# EAGLE design PocketBeagle (EAGLE 9.6.2)
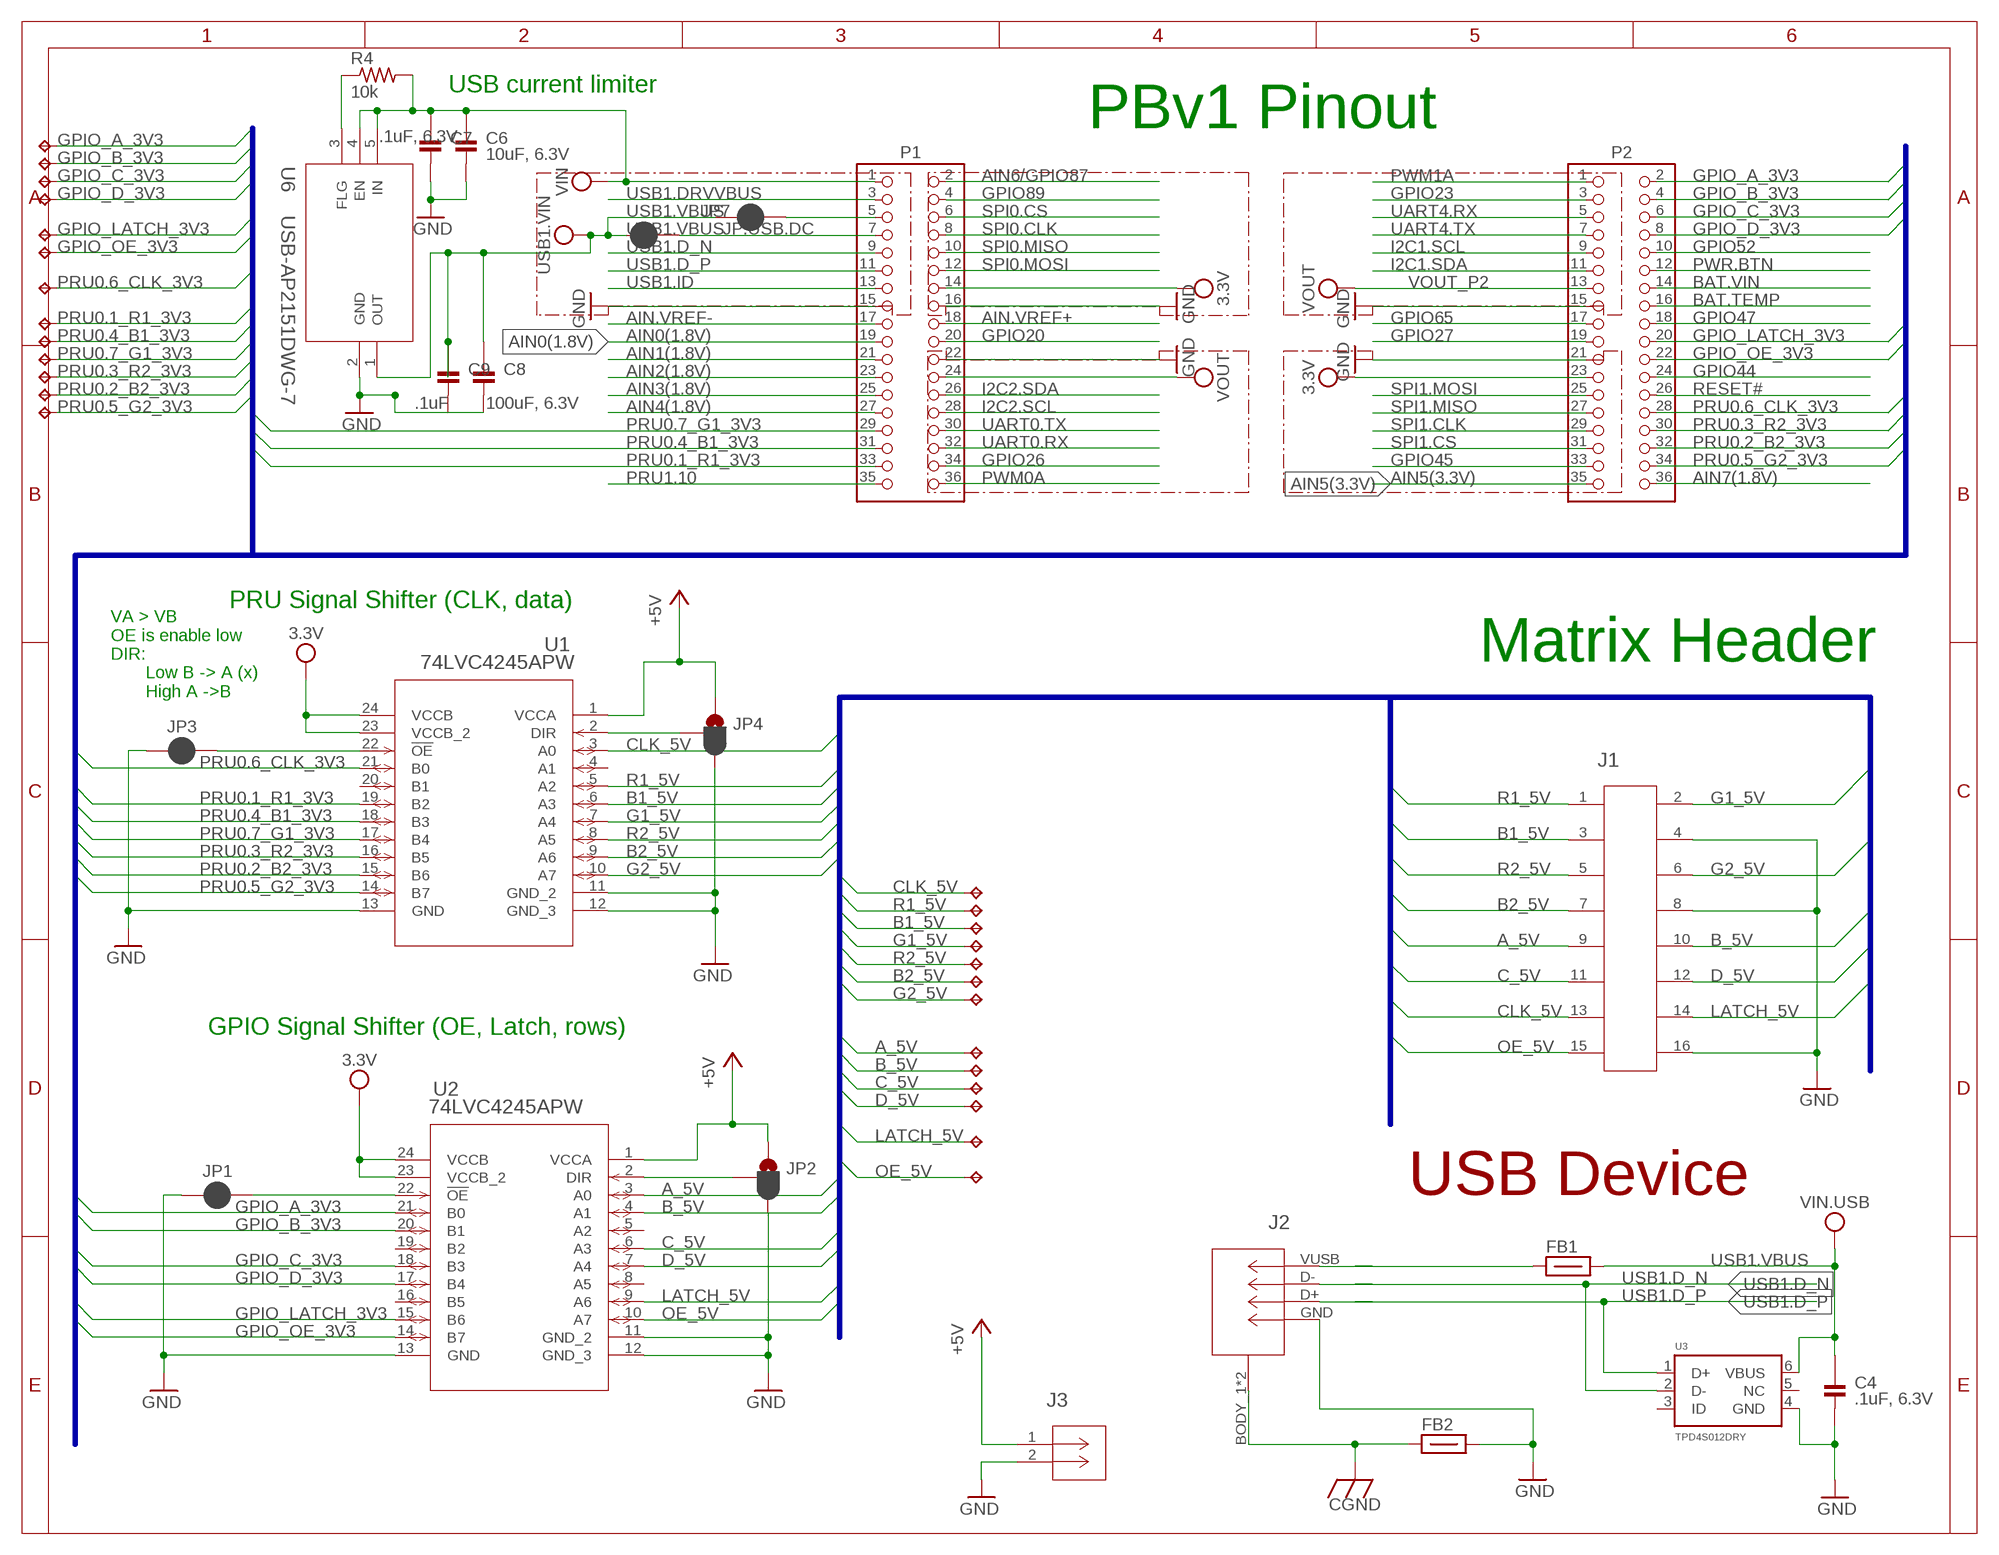
[diagram p0: schematic, sheet 1, part 1 of 2]
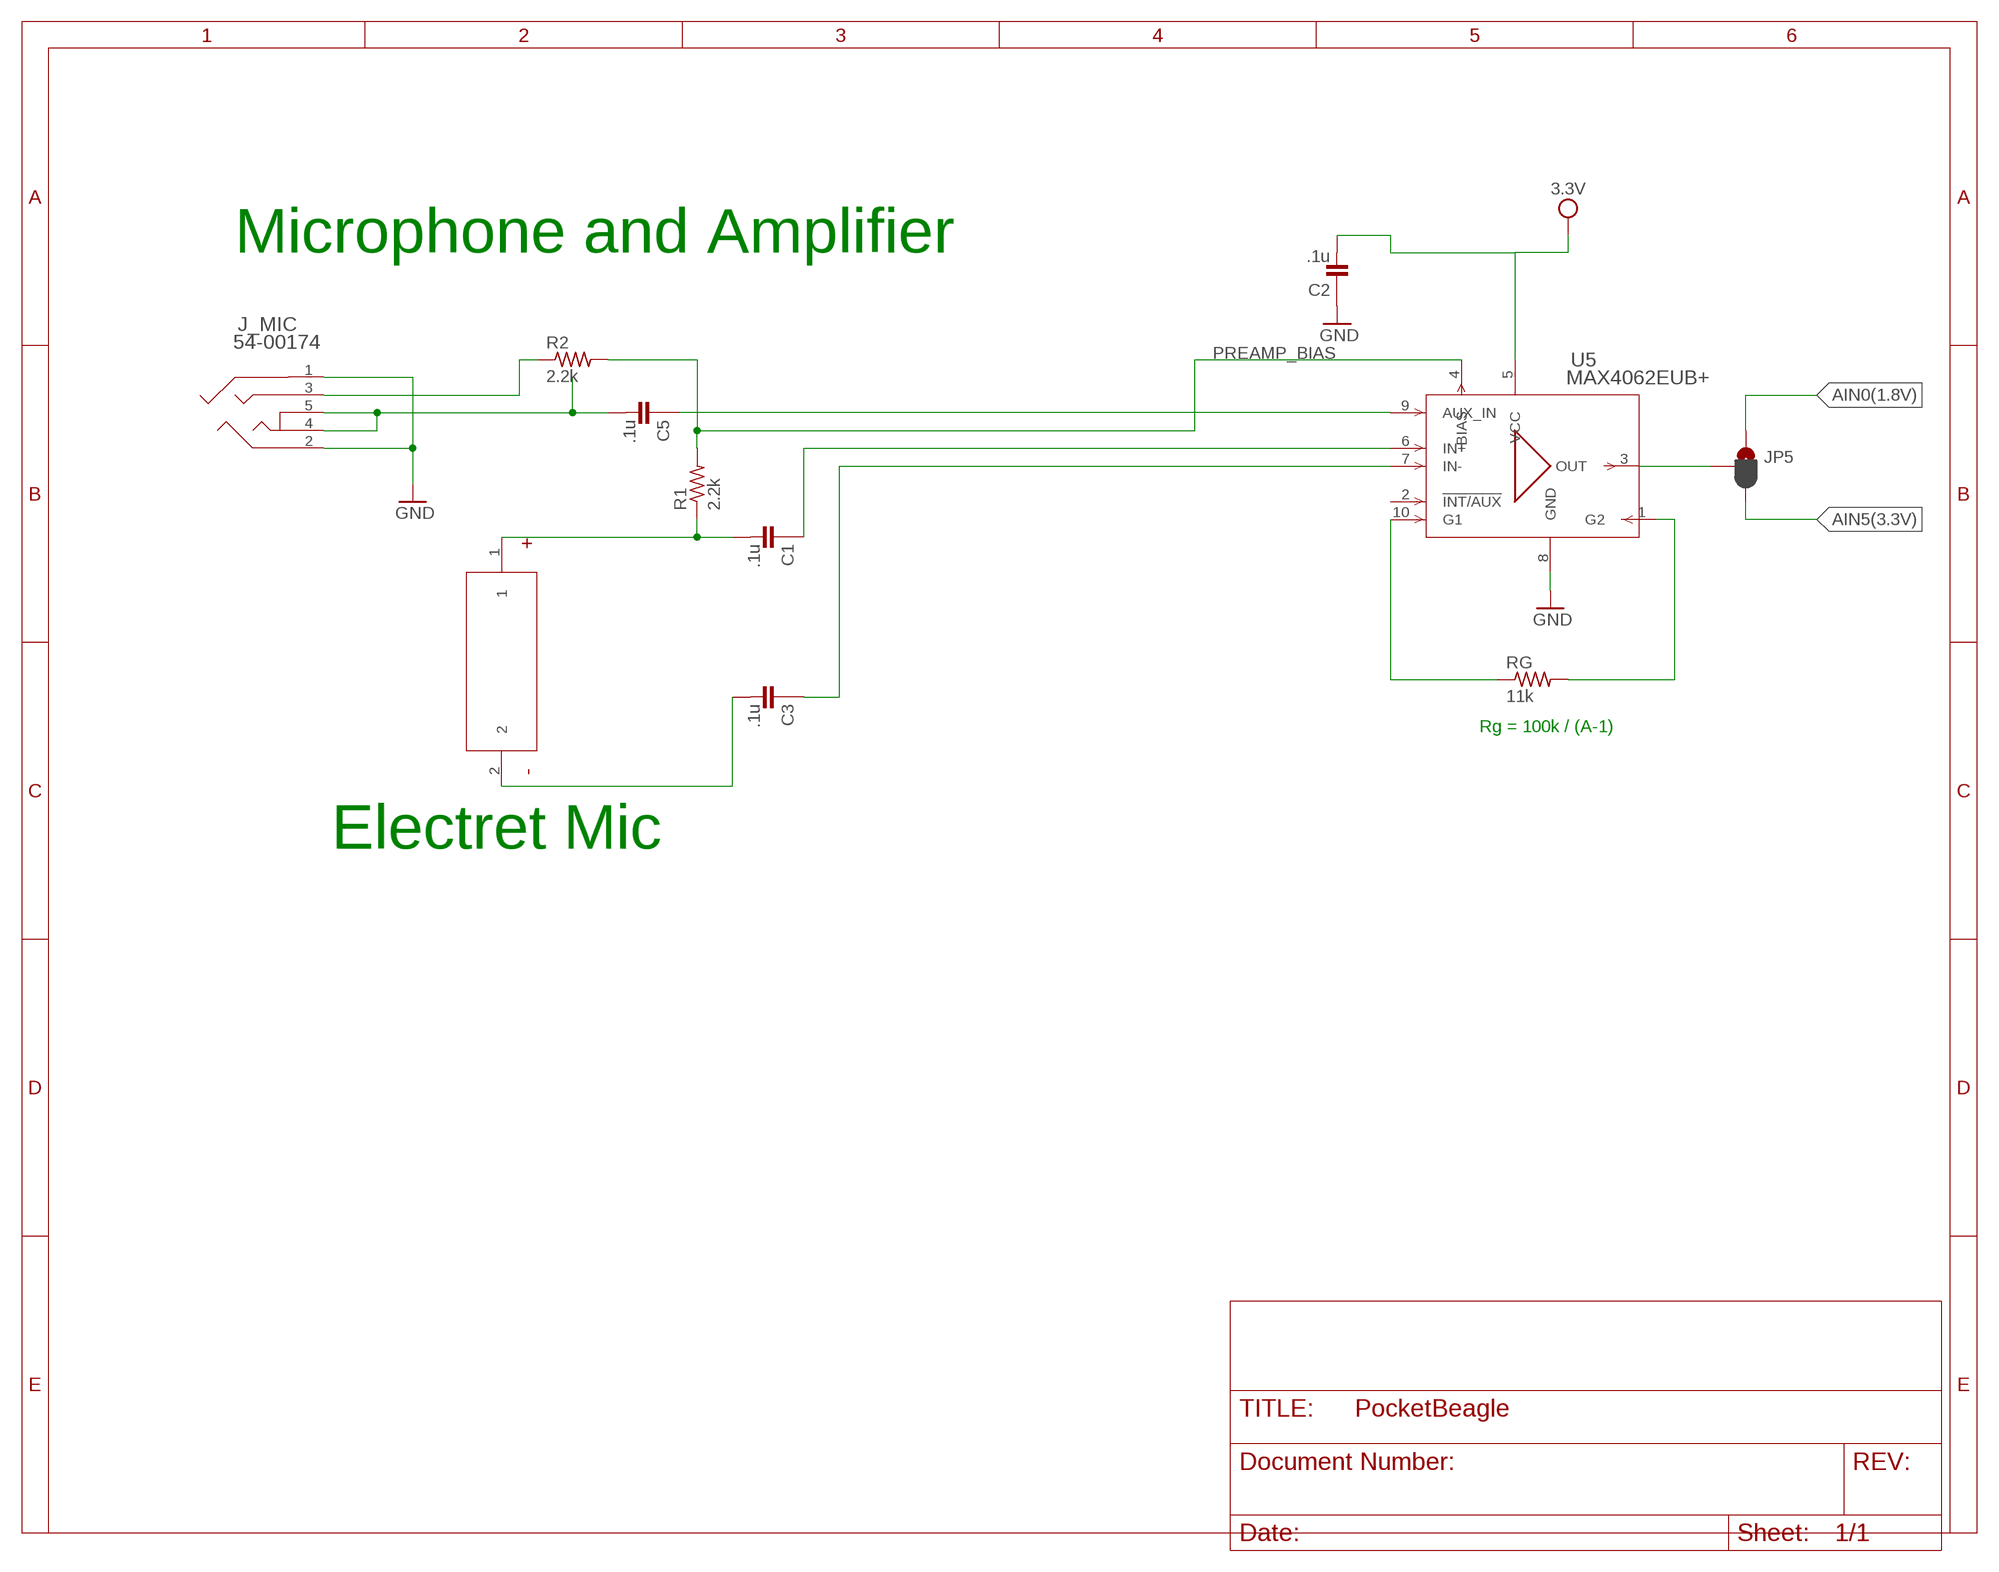
[diagram p1: schematic, sheet 1, part 2 of 2]

## Parts
C1  .1u  C-0805  [C0805]
C2  .1u  C-0805  [C0805]
C3  .1u  C-0805  [C0805]
C4  .1uF, 6.3V  C-0603  [C0603]
C5  .1u  C-0805  [C0805]
C6  10uF, 6.3V  C-0603  [C0603]
C7  .1uF, 6.3V  C-0603  [C0603]
C8  100uF, 6.3V  C-1206  [C1206]
C9  .1uF  C-0603  [C0603]
FB1  FB-(INCH)-0603  [0603]
FB2  FB-(INCH)-0603  [0603]
J1  SBH11-PBPC-D08-ST-BK  [CONN16_SBH11-PBPC-D08-ST-BK_SU]
J2  USB-61400416021  [CONN4_416021_WRE]
J3  1935161  [CONN_1935161_PXC]
J_MIC  54-00174  [54-00174_TEN]
JP1  JUMPER-SMT_2_NC_PASTE  [SMT-JUMPER_2_LG_NC_PASTE_NO-SILK]
JP2  JUMPER-SMT_3_1-NC_PASTE_SILK  [SMT-JUMPER_3_1-NC_PASTE_SILK]
JP3  JUMPER-SMT_2_NC_PASTE  [SMT-JUMPER_2_LG_NC_PASTE_NO-SILK]
JP4  JUMPER-SMT_3_1-NC_PASTE_SILK  [SMT-JUMPER_3_1-NC_PASTE_SILK]
JP5  JUMPER-SMT_3_1-NC_PASTE_SILK  [SMT-JUMPER_3_1-NC_PASTE_SILK]
JP7  JUMPER-SMT_2_NC_PASTE  [SMT-JUMPER_2_LG_NC_PASTE_NO-SILK]
JP.USB.DC  JUMPER-SMT_2_NC_PASTE  [SMT-JUMPER_2_LG_NC_PASTE_NO-SILK]
P1  2X18-(INCH)-0.1-TH-(35MIL-DIA)-W/O-SILK  [TH-2X18-(35MIL-DIA)-W/O-SILK]
P2  2X18-(INCH)-0.1-TH-(35MIL-DIA)-W/O-SILK  [TH-2X18-(35MIL-DIA)-W/O-SILK]
R1  2.2k  R-0805  [R0805]
R2  2.2k  R-0805  [R0805]
R4  10k  R-0805  [R0805]
RG  11k  R-0805  [R0805]
T.A.3  TPTP08R  [TP08R]
T.A.5  TPTP08R  [TP08R]
T.B1.3  TPTP08R  [TP08R]
T.B1.5  TPTP08R  [TP08R]
T.B2.3  TPTP08R  [TP08R]
T.B2.5  TPTP08R  [TP08R]
T.B.3  TPTP08R  [TP08R]
T.B.5  TPTP08R  [TP08R]
T.C.3  TPTP08R  [TP08R]
T.C.5  TPTP08R  [TP08R]
T.CL.3  TPTP08R  [TP08R]
T.CL.5  TPTP08R  [TP08R]
T.D.3  TPTP08R  [TP08R]
T.D.5  TPTP08R  [TP08R]
T.G1.3  TPTP08R  [TP08R]
T.G1.5  TPTP08R  [TP08R]
T.G2.3  TPTP08R  [TP08R]
T.G2.5  TPTP08R  [TP08R]
T.L.3  TPTP08R  [TP08R]
T.L.5  TPTP08R  [TP08R]
T.O.3  TPTP08R  [TP08R]
T.O.5  TPTP08R  [TP08R]
T.R1.3  TPTP08R  [TP08R]
T.R1.5  TPTP08R  [TP08R]
T.R2.3  TPTP08R  [TP08R]
T.R2.5  TPTP08R  [TP08R]
U1  74LVC4245APW  [SOT355-1_NEX]
U2  74LVC4245APW  [SOT355-1_NEX]
U3  TPD4S012DRY  TPD4S012DRYR  [SON-6(TI)-DRY]
U4  CMA-4544PF-W  [CMA_CUI_9P7X9P7_CUD]
U5  MAX4062EUB+  [21-0061L]
U6  USB-AP2151DWG-7  [SOT25_DIO]

## Nets
3V3: C2.2 P1.14 P2.23 U1.23(VCCB_2) U1.24(VCCB) U2.23(VCCB_2) U2.24(VCCB) U5.5(VCC) ; supply symbol labelled 3.3V
+5V: J3.1 JP2.1 JP4.1 U1.1(VCCA) U2.1(VCCA)
A_5V: J1.9 T.A.5.TP U2.3(A0)
AIN0(1.8V): JP5.1 P1.19
AIN1(1.8V): P1.21
AIN2(1.8V): P1.23
AIN3(1.8V): P1.25
AIN4(1.8V): P1.27
AIN5(3.3V): JP5.3 P2.35
AIN6/GPIO87: P1.2
AIN7(1.8V): P2.36
AIN.VREF+: P1.18
AIN.VREF-: P1.17
B1_5V: J1.3 T.B1.5.TP U1.6(A3)
B2_5V: J1.7 T.B2.5.TP U1.9(A6)
B_5V: J1.10 T.B.5.TP U2.4(A1)
BAT.TEMP: P2.16
BAT.VIN: P2.14
C_5V: J1.11 T.C.5.TP U2.6(A3)
CGND: FB2.1 J2.BODY_1(BODY) J2.BODY_2(BODY)
CLK_5V: J1.13 T.CL.5.TP U1.3(A0)
D_5V: J1.12 T.D.5.TP U2.7(A4)
G1_5V: J1.2 T.G1.5.TP U1.7(A4)
G2_5V: J1.6 T.G2.5.TP U1.10(A7)
GND [power]: C2.1 C4.2 C6.2 C7.2 C8.2 C9.2 FB2.2 J1.4 J1.8 J1.16 J2.GND(DGND) J3.2 J_MIC.1 J_MIC.2 JP1.2 JP2.3 JP3.2 JP4.3 P1.15 P1.16 P1.22 P2.15 P2.21 U1.11(GND_2) U1.12(GND_3) U1.13(GND) U2.11(GND_2) U2.12(GND_3) U2.13(GND) U3.4(GND) U5.8(GND) U6.2(GND)
GPIO20: P1.20
GPIO23: P2.3
GPIO26: P1.34
GPIO27: P2.19
GPIO44: P2.24
GPIO45: P2.33
GPIO47: P2.18
GPIO52: P2.10
GPIO65: P2.17
GPIO89: P1.4
GPIO_A_3V3: P2.2 T.A.3.TP U2.21(B0)
GPIO_B_3V3: P2.4 T.B.3.TP U2.20(B1)
GPIO_C_3V3: P2.6 T.C.3.TP U2.18(B3)
GPIO_D_3V3: P2.8 T.D.3.TP U2.17(B4)
GPIO_LATCH_3V3: P2.20 T.L.3.TP U2.15(B6)
GPIO_OE_3V3: P2.22 T.O.3.TP U2.14(B7)
I2C1.SCL: P2.9
I2C1.SDA: P2.11
I2C2.SCL: P1.28
I2C2.SDA: P1.26
JACK_TIP: C5.2 J_MIC.4 J_MIC.5
LATCH_5V: J1.14 T.L.5.TP U2.9(A6)
N$1: JP1.1 U2.22(!OE)
N$2: JP2.2 U2.2(DIR)
N$4: J_MIC.3 R2.1
N$5: C3.2 U4.2
N$6: JP3.1 U1.22(!OE)
N$7: C1.2 R1.1 U4.1
N$8: C1.1 U5.6(IN+)
N$9: JP4.2 U1.2(DIR)
N$10: C3.1 U5.7(IN-)
N$11: RG.2 U5.1(G2)
N$12: RG.1 U5.10(G1)
N$13: C5.1 U5.9(AUX_IN)
N$14: JP5.2 U5.3(OUT)
N$15: JP7.1 P1.5
N$16: JP.USB.DC.1 P1.7
N$17: R4.1 U6.3(FLG)
OE_5V: J1.15 T.O.5.TP U2.10(A7)
PREAMP_BIAS: R1.2 R2.2 U5.4(BIAS)
PRU0.1_R1_3V3: P1.33 T.R1.3.TP U1.19(B2)
PRU0.2_B2_3V3: P2.32 T.B2.3.TP U1.15(B6)
PRU0.3_R2_3V3: P2.30 T.R2.3.TP U1.16(B5)
PRU0.4_B1_3V3: P1.31 T.B1.3.TP U1.18(B3)
PRU0.5_G2_3V3: P2.34 T.G2.3.TP U1.14(B7)
PRU0.6_CLK_3V3: P2.28 T.CL.3.TP U1.21(B0)
PRU0.7_G1_3V3: P1.29 T.G1.3.TP U1.17(B4)
PRU1.10: P1.35
PWM0A: P1.36
PWM1A: P2.1
PWR.BTN: P2.12
R1_5V: J1.1 T.R1.5.TP U1.5(A2)
R2_5V: J1.5 T.R2.5.TP U1.8(A5)
RESET#: P2.26
SPI0.CLK: P1.8
SPI0.CS: P1.6
SPI0.MISO: P1.10
SPI0.MOSI: P1.12
SPI1.CLK: P2.29
SPI1.CS: P2.31
SPI1.MISO: P2.27
SPI1.MOSI: P2.25
UART0.RX: P1.32
UART0.TX: P1.30
UART4.RX: P2.5
UART4.TX: P2.7
USB1.D_N: J2.D- P1.9 U3.2(D-)
USB1.D_P: J2.D+ P1.11 U3.1(D+)
USB1.DRVVBUS: P1.3
USB1.ID: P1.13
USB1.VBUS: C4.1 C8.1 C9.1 FB1.2 JP7.2 JP.USB.DC.2 U3.6(VBUS) U6.1(OUT) ; supply symbol labelled VIN.USB, USB1.VIN
VBUS.RAW: FB1.1 J2.VUSB(5V)
VIN: C6.1 C7.1 P1.1 R4.2 U6.4(EN) U6.5(IN)
VOUT_P1: P1.24 ; supply symbol labelled VOUT
VOUT_P2: P2.13 ; supply symbol labelled VOUT
Unconnected: U1.4(A1) U1.20(B1) U2.5(A2) U2.8(A5) U2.16(B5) U2.19(B2) U3.3(ID) U3.5(NC) U5.2(!INT/AUX)

## Buses
MTX_SIG:+5V,5V,A_5V,B1_5V,B2_5V,B_5V,C_5V,CLK_5V,D_5V,G1_5V,G2_5V,LATCH_5V,OE_5V,R1_5V,R2_5V
PB_SIG:3.3V,3V3,GPIO_A_3V3,GPIO_B_3V3,GPIO_C_3V3,GPIO_D_3V3,GPIO_LATCH_3V3,GPIO_OE_3V3,PRU0.1_R1_3V3,PRU0.2_B2_3V3,PRU0.3_R2_3V3,PRU0.4_B1_3V3,PRU0.5_G2_3V3,PRU0.6_CLK_3V3,PRU0.7_G1_3V3

## Notes on the sheet
- USB current limiter
- PBv1 Pinout
- Microphone and Amplifier
- PRU Signal Shifter (CLK, data)
- Matrix Header
- VA > VB
  OE is enable low
  DIR: 
         Low B -> A (x)
         High A ->B
- Rg = 100k / (A-1)
- Electret Mic
- GPIO Signal Shifter (OE, Latch, rows)
- USB Device

## Library data of the parts
C1-C9 = Capacitors:C-: Capacitor, Surface Mount; MANUFACTURER: Kemet; TC: X7R; TOL: 10%; VOLTAGE: 6.3V
FB1 FB2 = GHI-BasicComponents:FB-(INCH)-; MPN: LI0603G121R-10
J1 = Connectors:SBH11-PBPC-D08-ST-BK; COPYRIGHT: Copyright (C) 2023 Ultra Librarian. All rights reserved.; MANUFACTURER_PART_NUMBER: SBH11-PBPC-D08-ST-BK; MFR_NAME: Sullins; TYPE: Headers, Male Pins
J2 = Connectors:USB-61400416021; COPYRIGHT: Copyright (C) 2023 Ultra Librarian. All rights reserved.; MANUFACTURER_PART_NUMBER: 61400416021; MFR_NAME: Wurth Electronics
J3 = Connectors:1935161; COPYRIGHT: Copyright (C) 2023 Ultra Librarian. All rights reserved.; MANUFACTURER_PART_NUMBER: 1935161; MFR_NAME: Phoenix Contact
J_MIC = Connectors:54-00174; COPYRIGHT: Copyright (C) 2023 Ultra Librarian. All rights reserved.; MANUFACTURER_PART_NUMBER: 54-00174; MFR_NAME: Tensility
JP1 JP3 JP7 JP.USB.DC = Connectors:JUMPER-SMT_2_NC_PASTE: Normally closed solder jumper This jumper has an aperture in the stencil to allow solder paste to bridge the split in the wire so it's normally closed (NC). Wick off the solder to open the connection. Reapply solder to reclose the connection.
JP2 JP4 JP5 = Connectors:JUMPER-SMT_3_1-NC_PASTE: Normally closed solder jumper (1 of 2 connections) This jumper has an aperture in the stencil to allow solder paste to bridge one of the two connections. One connection is normally closed (NC), while the other is normally open (NO). Wick off the solder to open the connection. Reapply solder to reclose the connection. Apply solder to the other side instead to change the current path.
P1 P2 = GHI-Headers:2X18-(INCH)-0.1-; MPN: 61303621121
R1 R2 R4 RG = Resistors:R-: Resistor, Surface Mount; MANUFACTURER: Panasonic; TOL: 5%
T.A.3 T.A.5 T.B1.3 T.B1.5 T.B2.3 T.B2.5 T.B.3 T.B.5 T.C.3 T.C.5 T.CL.3 T.CL.5 T.D.3 T.D.5 T.G1.3 T.G1.5 T.G2.3 T.G2.5 T.L.3 T.L.5 T.O.3 T.O.5 T.R1.3 T.R1.5 T.R2.3 T.R2.5 = TestPoints:TP: Test pad
U1 U2 = Logic:74LVC4245APW; COPYRIGHT: Copyright (C) 2023 Ultra Librarian. All rights reserved.; MANUFACTURER_PART_NUMBER: 74LVC4245APW; MFR_NAME: Nexperia
U3 = GHI-IC:TPD4S012DRYR
U4 = Sensors:CMA-4544PF-W; COPYRIGHT: Copyright (C) 2023 Ultra Librarian. All rights reserved.; MANUFACTURER_PART_NUMBER: CMA-4544PF-W; MFR_NAME: CUI Devices
U5 = Amplifiers:MAX4062EUB+; COPYRIGHT: Copyright (C) 2023 Ultra Librarian. All rights reserved.; MANUFACTURER_PART_NUMBER: MAX4062EUB+; MFR_NAME: Analog Devices Inc
U6 = Switches:USB-AP2151DWG-7; COPYRIGHT: Copyright (C) 2023 Ultra Librarian. All rights reserved.; MANUFACTURER_PART_NUMBER: AP2151DWG-7; MFR_NAME: Diodes Inc

## Board
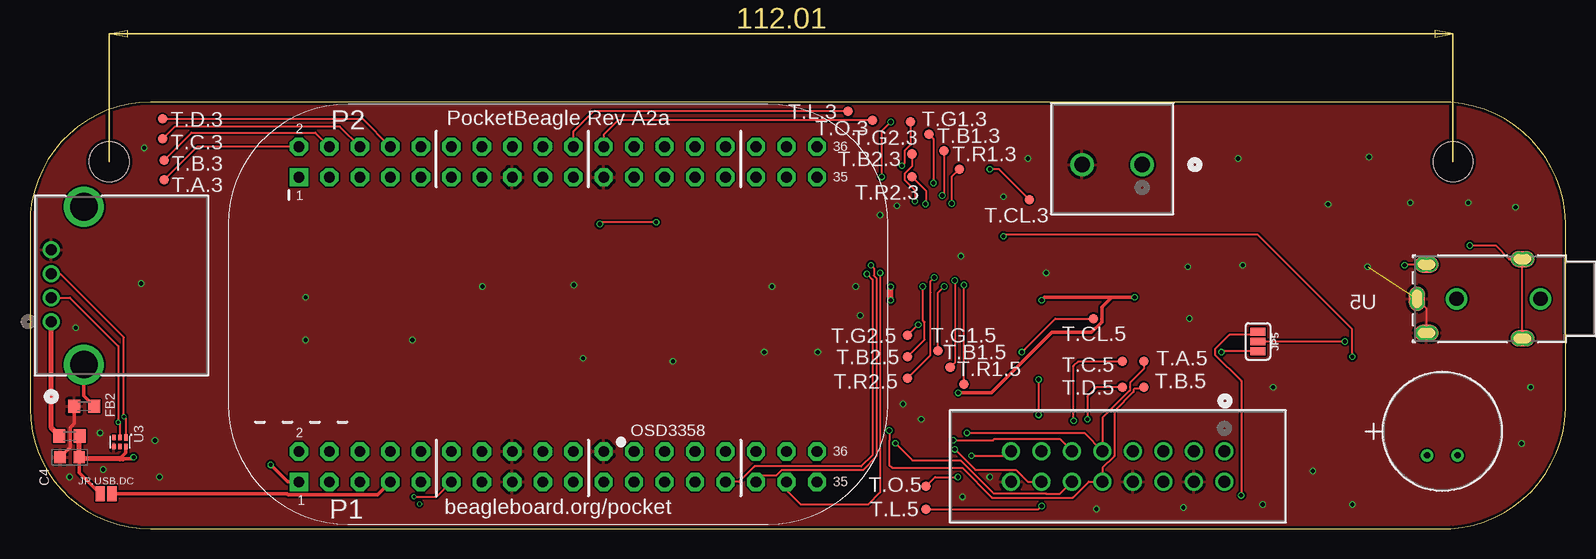
[diagram p2: board, top side]
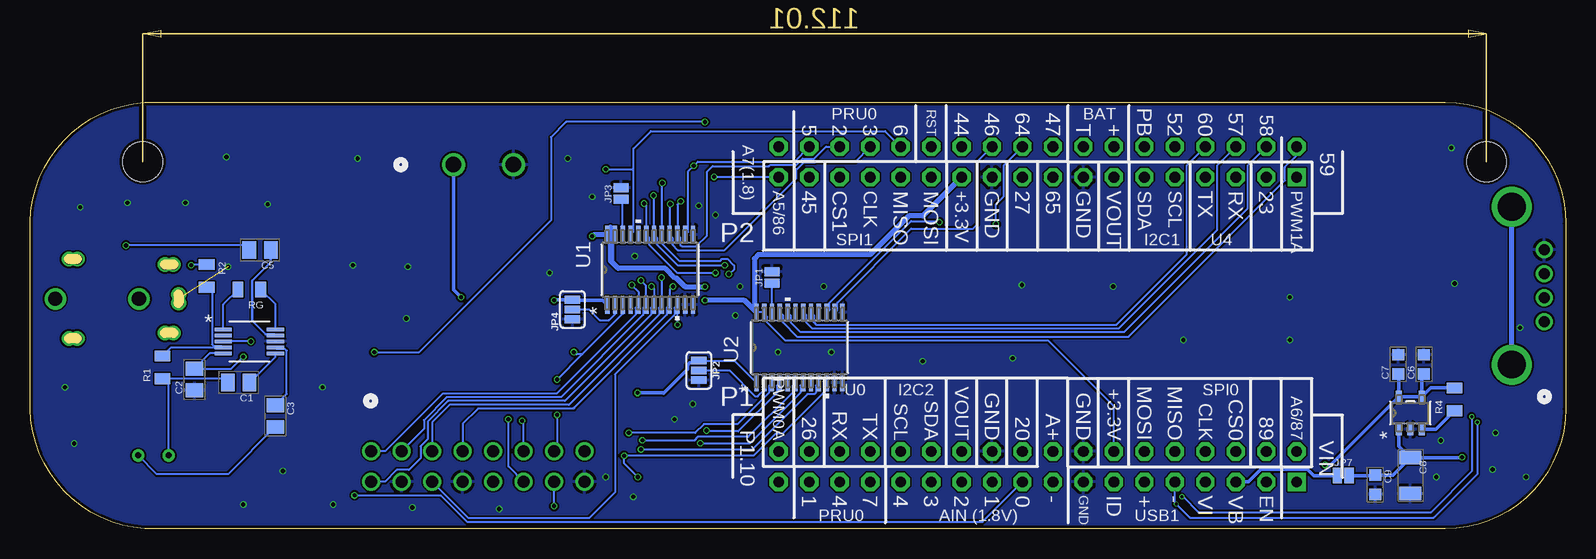
[diagram p3: board, bottom side, seen from below]

Size 128.02 x 35.56 mm. Coordinates in mm from the lower left corner, seen from the top.
Outline: 0,25.44 0,10 arc90 10.05,0 117.51,0 arc90 128.02,10 128.02,25.57 arc90 117.51,35.56 10.05,35.56 arc90 0,25.44
Copper layers (1*16): Top 0.035mm / dielectric 1.5mm / Bottom 0.035mm
Design rules "jlc *": minimum track width 6mil, minimum drill 0.3mm, track to track 6mil, track to pad 6mil, pad to pad 6mil, via to via 6mil, smd to smd 6mil, copper to edge 10mil, drill to drill 6mil, minimum pad ring 3mil, minimum via ring 3mil, stop-mask expansion 4mil, vias tented up to drill 0mil, thermal gap 10mil
Holes 3.3 mm at 6.6,30.61 118.62,30.61

### Footprints (pad centres in the part's own frame; a part is rotated, then mirrored left to right if it is on the bottom)
C0805 = smd 1.15 x 1.45: 1 -0.9,0; 2 0.9,0
C0603 = smd 0.95 x 1: 1 -0.8,0; 2 0.8,0
C1206 = smd 1.15 x 1.8: 1 -1.5,0; 2 1.5,0
0603 = smd 1 x 1.1: 1 -0.85,0; 2 0.85,0
CONN16_SBH11-PBPC-D08-ST-BK_SU = drill 0.991 pad 1.499: 1 0,-2.54; 2 0,0; 3 2.54,-2.54; 4 2.54,0; 5 5.08,-2.54; 6 5.08,0; 7 7.62,-2.54; 8 7.62,0; 9 10.16,-2.54; 10 10.16,0; 11 12.7,-2.54; 12 12.7,0; 13 15.24,-2.54; 14 15.24,0; 15 17.78,-2.54; 16 17.78,0
CONN4_416021_WRE = drill 2.311 pad 2.819: BODY_1 -3.581,-2.718; BODY_2 9.576,-2.718 | drill 0.914 pad 1.422: D+ 3.988,0; D- 2.007,0; GND 5.994,0; VUSB 0,0
CONN_1935161_PXC = drill 1.295 pad 1.803: 1 0,0; 2 5.004,0
54-00174_TEN = smd 2.007 x 1.321: 1 0,-6.052 | smd 1.321 x 2.007: 2 2.85,-5.251; 3 -2.85,-5.251; 4 -3.299,2.748; 5 3.299,2.748 | drill 1.194 pad 1.194: 6 0,4.242; 7 0,-2.743 | drill 0.813 pad 0.813: S_1_H1 0.356,-6.045; S_1_H2 -0.356,-6.045; S_2_H1 2.845,-4.902; S_2_H2 2.845,-5.588; S_3_H1 -2.845,-4.902; S_3_H2 -2.845,-5.588; S_4_H1 -3.302,3.099; S_4_H2 -3.302,2.413; S_5_H1 3.302,3.099; S_5_H2 3.302,2.413
SMT-JUMPER_2_LG_NC_PASTE_NO-SILK = smd 0.762 x 1.27: 1 -0.483,0; 2 0.483,0
SMT-JUMPER_3_1-NC_PASTE_SILK = smd 0.635 x 1.27: 1 -0.813,0; 2 0,0; 3 0.813,0
TH-2X18-(35MIL-DIA)-W/O-SILK = drill 0.889 pad 1.524 square: 1 -21.59,-1.27 | drill 0.889 pad 1.524 octagon: 2 -21.59,1.27; 3 -19.05,-1.27; 4 -19.05,1.27; 5 -16.51,-1.27; 6 -16.51,1.27; 7 -13.97,-1.27; 8 -13.97,1.27; 9 -11.43,-1.27; 10 -11.43,1.27; 11 -8.89,-1.27; 12 -8.89,1.27; 13 -6.35,-1.27; 14 -6.35,1.27; 15 -3.81,-1.27; 16 -3.81,1.27; 17 -1.27,-1.27; 18 -1.27,1.27; 19 1.27,-1.27; 20 1.27,1.27; 21 3.81,-1.27; 22 3.81,1.27; 23 6.35,-1.27; 24 6.35,1.27; 25 8.89,-1.27; 26 8.89,1.27; 27 11.43,-1.27; 28 11.43,1.27; 29 13.97,-1.27; 30 13.97,1.27; 31 16.51,-1.27; 32 16.51,1.27; 33 19.05,-1.27; 34 19.05,1.27; 35 21.59,-1.27; 36 21.59,1.27
R0805 = smd 0.9 x 1.3: 1 -0.95,0; 2 0.95,0
TP08R = smd 0.8 x 0.8: TP 0,0
SOT355-1_NEX = smd 1.473 x 0.356: 1 -2.921,3.575; 2 -2.921,2.925; 3 -2.921,2.275; 4 -2.921,1.625; 5 -2.921,0.975; 6 -2.921,0.325; 7 -2.921,-0.325; 8 -2.921,-0.975; 9 -2.921,-1.625; 10 -2.921,-2.275; 11 -2.921,-2.925; 12 -2.921,-3.575; 13 2.921,-3.575; 14 2.921,-2.925; 15 2.921,-2.275; 16 2.921,-1.625; 17 2.921,-0.975; 18 2.921,-0.325; 19 2.921,0.325; 20 2.921,0.975; 21 2.921,1.625; 22 2.921,2.275; 23 2.921,2.925; 24 2.921,3.575
SON-6(TI)-DRY = smd 0.3 x 0.52: 1 -0.5,-0.38 | smd 0.3 x 0.49: 2 0,-0.375; 3 0.5,-0.375; 4 0.5,0.375; 5 0,0.375; 6 -0.5,0.375
CMA_CUI_9P7X9P7_CUD = drill 0.508 pad 1.016: 1 0,-2.007; 2 2.54,-2.007
21-0061L = smd 1.422 x 0.279: 1 -2.172,1; 2 -2.172,0.5; 3 -2.172,0; 4 -2.172,-0.5; 5 -2.172,-1; 6 2.172,-1; 7 2.172,-0.5; 8 2.172,0; 9 2.172,0.5; 10 2.172,1
SOT25_DIO = smd 1.006 x 0.5: 1 -1.353,0.95; 2 -1.353,0; 3 -1.353,-0.95; 4 1.353,-0.95; 5 1.353,0.95

### Placement (x,y rotation side)
C1  110.62,12.19 180 bottom
C2  114.3,12.45 90 bottom
C3  107.57,9.4 270 bottom
C4  3.3,5.97 180 top
C5  108.84,23.24 180 bottom
C6  11.81,13.72 90 bottom
C7  13.97,13.72 90 bottom
C8  12.95,4.45 270 bottom
C9  15.88,3.68 270 bottom
FB1  3.3,7.75 0 top
FB2  4.52,10.21 180 top
J1  99.57,3.94 180 top
J2  1.78,17.27 90 top
J3  92.71,30.35 180 top
J_MIC  121.67,19.18 270 top
JP1  66.17,20.95 90 bottom
JP2  72.26,13.21 270 bottom
JP3  78.74,27.94 90 bottom
JP4  82.8,18.29 270 bottom
JP5  102.36,15.62 270 top
JP7  18.54,4.45 0 bottom
JP.USB.DC  6.35,2.92 180 top
P1  44.01,5.18 0 top
P2  44.01,30.58 0 top
R1  116.97,13.46 90 bottom
R2  113.28,21.08 270 bottom
R4  9.27,10.79 90 bottom
RG  109.73,19.94 180 bottom
T.A.3  11.18,29.08 180 top
T.A.5  92.84,13.97 0 top
T.B1.3  76.2,31.5 0 top
T.B1.5  76.71,13.46 0 top
T.B2.3  73.53,31.24 180 top
T.B2.5  73.15,14.35 180 top
T.B.3  11.18,30.73 180 top
T.B.5  92.84,11.81 0 top
T.C.3  11.05,32.51 0 top
T.C.5  91.06,13.97 0 top
T.CL.3  83.31,27.43 180 top
T.CL.5  88.65,17.53 90 top
T.D.3  11.05,34.16 0 top
T.D.5  91.06,11.81 0 top
T.G1.3  74.93,32.89 0 top
T.G1.5  75.69,14.86 0 top
T.G2.3  73.41,33.91 180 top
T.G2.5  73.15,16.13 180 top
T.L.3  68.2,34.8 180 top
T.L.5  74.68,1.65 0 top
T.O.3  70.23,34.04 90 top
T.O.5  74.68,3.56 0 top
T.R1.3  77.47,29.97 0 top
T.R1.5  77.85,12.06 0 top
T.R2.3  73.53,29.34 180 top
T.R2.5  73.15,12.57 180 top
U1  76.33,21.59 90 bottom
U2  63.88,15.11 90 bottom
U3  7.49,7.24 180 top
U4  116.46,8.13 0 top
U5  109.73,15.62 0 bottom
U6  12.95,9.65 90 bottom

### Tracks (layer width: path | path; a pad name or v marks a point on that pad's centre or on a via)
3V3  (via drill 0.35)
  Top 0.152: v110.24,14.35 110.19,14.39 110.19,16.68 102.36,24.51 81.28,24.51 v81.15,24.38 | 71.75,20.07 v71.75,20.18
  Top 0.406: v71.75,19.05 71.75,20.07
  Bottom 0.152: U2.23 66.93,18.03 | 66.93,18.03 U2.24 67.64,18.21 68.47,19.05 | U5.5 113.03,14.62 C2.2 111.24,13.35 v110.24,14.35 | 80.03,24.38 v81.15,24.38 | P1.14 37.66,10.23 43.13,15.7 65.06,15.7 66.56,17.2 66.56,17.67 66.93,18.03 | 73.15,20.18 73.28,20.18 | 73.39,20.18 73.41,20.19 | 78.99,21.72 79.38,22.1 79.38,24.51
  Bottom 0.406: P2.23 53.59,26.09 54.75,26.09 57.98,22.86 67.31,22.86 67.64,22.53 67.64,18.21 | U2.24 68.47,19.05 v71.75,19.05 | 73.15,20.18 v71.75,20.18 | 73.28,20.18 73.39,20.18 | 73.41,20.19 74.12,20.9 74.24,20.9 75.06,21.72 78.99,21.72 79.63,22.35 79.63,24.51 | 79.63,24.51 U1.24 81.03,24.51 v81.15,24.38 | U1.23 79.38,24.51 | 79.38,24.51 79.63,24.51 | 79.38,24.51 79.38,24.89 79.63,25.15 79.63,24.51
+5V  (via drill 0.35)
  Top 0.305: v92.08,19.3 90.17,19.3 | 90.17,19.3 84.58,19.3 v84.33,19.05 | 90.17,19.3 89.35,18.48 89.35,17.23 88.5,16.38 85.19,16.38 80.16,11.36 77.4,11.36 v77.37,11.33
  Bottom 0.152: 82.86,19.05 JP4.1 | JP2.1 69.28,14.02 U2.1
  Bottom 0.305: U1.1 80.28,19.05 82.86,19.05 | JP4.1 84.28,19.1 v84.33,19.05 | J3.1 92.71,19.94 v92.08,19.3 | v77.37,11.33 75.22,11.33 75.18,11.3 73.2,13.28 73.2,13.65 73.02,13.83 72.45,13.83 JP2.1
A_5V  (via drill 0.35)
  Top 0.152: v78.11,8 87.88,8 J1.9 89.41,9.27 91.69,11.55 91.69,12.19 92.84,13.34 T.A.5.TP
  Bottom 0.152: U2.3 66.4,11.95 66.4,11.36 69.03,8.73 71.85,8.73 72.57,8 v78.11,8
AIN0(1.8V)  (via drill 0.35)
  Top 0.152: JP5.1 102.09,16.17 100,16.17 98.78,14.95 98.78,14.51 100.97,12.33 v100.97,2.79
  Bottom 0.152: v100.97,2.79 93.78,2.79 91.57,0.58 48.61,0.58 P1.19
AIN5(3.3V)  (via drill 0.35)
  Top 0.152: JP5.3 99.39,14.81 v99.31,14.73 | v71.75,33.91 70.99,33.15 v70.99,29.34
  Bottom 0.152: v99.31,14.73 95.56,14.73 84.58,25.71 84.58,32.64 83.31,33.91 v71.75,33.91 | P2.35 70.99,29.31 v70.99,29.34
B1_5V  (via drill 0.35)
  Top 0.152: T.B1.5.TP 77.09,13.84 v77.09,20.7
  Bottom 0.152: J1.3 95.17,8.33 95.17,9.07 93.27,10.97 83.76,10.97 76.9,17.84 76.9,18.43 U1.6 76.71,18.73 76.71,20.32 v77.09,20.7
B2_5V  (via drill 0.35)
  Top 0.152: T.B2.5.TP 74.57,15.77 74.57,17.24 74.42,17.39 v74.42,20.19
  Bottom 0.152: J1.7 91.95,8.76 90.68,10.03 82.68,10.03 82.68,10.11 74.95,17.84 74.95,18.43 U1.9 74.7,19.91 v74.42,20.19
B_5V  (via drill 0.35)
  Top 0.152: v71.63,8.2 71.63,7.38 71.61,7.35 71.61,5.36 71.88,5.08 77.72,5.08 80.19,2.62 86.93,2.62 88.25,3.94 J1.10 89.41,5.09 90.39,6.07 90.39,9.82 91.99,11.42 91.99,11.6 92.08,11.68 92.71,11.68 T.B.5.TP
  Bottom 0.152: U2.4 65.75,11.95 65.75,11.36 68.98,8.13 71.56,8.13 v71.63,8.2
C_5V  (via drill 0.35)
  Top 0.152: v76.96,7.38 80.28,7.38 80.39,7.49 85.85,7.49 J1.11 | v87,9.02 87,13.59 87.38,13.97 T.C.5.TP
  Bottom 0.152: U2.6 64.45,11.95 64.45,11.36 68.14,7.67 72.36,7.67 72.66,7.37 76.94,7.37 v76.96,7.38 | J1.11 86.87,8.89 v87,9.02
CGND
  Top 0.305: FB2.1 4.5,11.09 J2.BODY_1
  Bottom 0.406: J2.BODY_1 J2.BODY_2
CLK_5V  (via drill 0.35)
  Top 0.152: v84.07,12.45 v84.07,9.5 | v82.68,14.73 85.47,17.53 T.CL.5.TP
  Bottom 0.152: U1.3 78.6,17.92 81.98,14.54 | 81.98,14.54 v84.07,12.45 | v84.07,9.5 84.07,6.73 J1.13 | 81.98,14.54 82.49,14.54 v82.68,14.73
D_5V  (via drill 0.35)
  Top 0.152: v72.14,7.13 73.56,5.71 77.57,5.71 80.33,2.96 84.67,2.96 84.71,2.92 85.85,2.92 J1.12 | T.D.5.TP 88.9,11.81 88.14,11.05 v88.14,9.14
  Bottom 0.152: U2.7 63.8,11.95 63.8,11.36 68.05,7.11 72.14,7.11 v72.14,7.13 | J1.12 88.14,5.21 v88.14,9.14
G1_5V  (via drill 0.35)
  Top 0.152: T.G1.5.TP 75.69,19.68 v76.2,20.19
  Bottom 0.152: J1.2 98.41,3.94 97.43,4.92 96.43,4.92 95.47,5.88 95.47,6.88 94.87,7.48 94.87,8.94 93.14,10.67 83.42,10.67 76.25,17.84 76.25,18.43 U1.7 76,20 v76.2,20.19
G2_5V  (via drill 0.35)
  Top 0.152: T.G2.5.TP v74.04,17.02
  Bottom 0.152: U1.10 74.17,18.55 | 74.17,18.55 74.3,18.43 74.3,17.84 79.25,12.88 79.25,3.05 81.41,0.89 91.44,0.89 J1.6 | v74.04,17.02 74.04,18.41 74.17,18.55
GND  (via drill 0.35)  (1 unrouted)
  Top 0.152: J_MIC.1 116.42,18.38 J_MIC.2
  Top 0.305: FB2.2 3.67,8.75 3.35,8.42 3.35,6.81 C4.2
  other vias: 22.99,19.3 22.99,15.75 31.88,15.75 37.72,20.19 45.34,20.32 46.1,14.22 53.59,13.97 61.21,14.73 65.66,14.73 61.85,20.19 68.83,20.19 69.22,17.78 72.77,10.41 74.3,9.14 80.01,4.32 77.72,2.67 88.9,1.65 96.14,1.78 102.74,2.03 110.24,2.03 106.93,4.83 124.33,7.11 125.09,11.81 103.63,11.81 96.65,17.53 96.52,21.84 101.09,21.97 100.71,30.86 111.63,30.99 111.51,21.84 123.83,26.8 119.89,27.18 115.06,27.18 108.2,27.05 83.19,30.86 81.15,27.69 84.71,21.34 9.53,31.75 9.27,20.45 10.79,4.32 10.41,7.37 3.3,4.32 6.1,4.95 5.84,8 3.81,16.76 70.87,26.16 72.26,26.92 77.6,22.73
  pour Bottom: -2.69,-3.17 132.97,-3.17 132.97,38.1 -2.54,38.1
  pour Top: -1.78,37.08 -1.78,-1.91 130.56,-1.91 130.56,37.08
GPIO_A_3V3
  Top 0.152: P2.2 13.94,31.85 T.A.3.TP
  Bottom 0.152: U2.21 65.26,17.79 65.26,17.2 64.06,16 36.45,16 23.41,29.04 23.41,30.17 22.42,31.16 P2.2
GPIO_B_3V3
  Top 0.152: T.B.3.TP 13.46,33.02 23.79,33.02 P2.4
  Bottom 0.152: U2.20 64.61,17.79 64.61,17.2 63.82,16.41 36.8,16.41 26.51,26.7 26.51,30.3 P2.4
GPIO_C_3V3
  Top 0.152: P2.6 25.82,33.53 12.06,33.53 T.C.3.TP
  Bottom 0.152: U2.18 63.31,17.79 63.31,17.2 62.82,16.71 37.26,16.71 29.05,24.93 29.05,30.3 P2.6
GPIO_D_3V3
  Top 0.152: T.D.3.TP 27.73,34.16 P2.8
  Bottom 0.152: U2.17 62.66,17.79 62.66,17.2 62.48,17.02 37.47,17.02 31.59,22.89 31.59,30.3 P2.8
GPIO_LATCH_3V3  (via drill 0.35)
  Top 0.152: v52.2,25.55 47.65,25.55 v47.5,25.4 | T.L.3.TP 46.99,34.8 45.28,33.09 P2.20
  Bottom 0.152: U2.15 61.36,18.28 61.36,18.86 54.57,25.65 52.3,25.65 v52.2,25.55 | v47.5,25.4 47.5,27.05 46.83,27.72 46.83,30.3 P2.20
GPIO_OE_3V3
  Top 0.152: T.O.3.TP 49.02,34.04 47.82,32.83 P2.22
  Bottom 0.152: U2.14 60.71,18.28 60.71,18.86 54.56,25.02 49.4,25.02 49.02,25.4 49.02,30.65 P2.22
JACK_TIP  (via drill 0.35)
  Top 0.152: v120.02,23.62 122.17,23.62 123.32,22.48 | 124.21,22.48 J_MIC.4 J_MIC.5
  Top 0.203: 123.32,22.48 124.21,22.48
  Bottom 0.152: C5.2 110.12,23.62 v120.02,23.62
LATCH_5V  (via drill 0.35)
  Top 0.152: J1.14 83.17,3.94 82.19,4.92 78.8,4.92 v77.09,6.63 | T.L.5.TP 84.07,1.65 v84.33,1.91
  Bottom 0.152: U2.9 62.5,11.95 62.5,11.36 62.63,11.23 63.22,11.23 67.84,6.6 77.07,6.6 v77.09,6.63 | v84.33,1.91 J1.14
N$1
  Bottom 0.152: U2.22 66.17,18.05 JP1.1
N$2
  Bottom 0.152: JP2.2 69.72,13.21 67.56,11.05 67.36,11.05 66.81,11.6 U2.2
N$4  (via drill 0.35)
  Top 0.152: v114.58,21.97 114.58,22.03 J_MIC.3
  Bottom 0.152: R2.1 114.52,22.03 v114.58,21.97
N$5
  Bottom 0.152: C3.2 111.5,4.57 117.45,4.57 U4.2
N$6
  Bottom 0.152: U1.22 78.6,27.32 JP3.1
N$7
  Bottom 0.152: C1.2 111.84,12.51 R1.1 116.46,12 U4.1
N$8
  Bottom 0.152: C1.1 107.56,14.35 U5.6
N$9
  Bottom 0.152: JP4.2 81.41,18.29 80.52,17.4 79.76,17.4 79.25,17.9 U1.2
N$10
  Bottom 0.152: U5.7 107.42,14.99 106.75,14.99 106.62,14.86 106.62,11.25 C3.1
N$11
  Bottom 0.152: U5.1 111.9,18.72 RG.2
N$12
  Bottom 0.152: U5.10 107.56,18.72 RG.1
N$13
  Bottom 0.203: U5.9 107.66,16.23 108.37,16.23 109.48,17.34 109.48,20.69 107.94,22.24 C5.1
N$14  (via drill 0.35)
  Top 0.152: JP5.2 v109.6,15.62
  Bottom 0.152: v109.6,15.62 U5.3
N$15
  Bottom 0.305: P1.5 26.47,3.91 25.4,4.98 21.53,4.98 21,4.45 JP7.1
N$16
  Top 0.305: JP.USB.DC.1 21.45,2.92 21.53,2.84 28.97,2.84 P1.7
N$17
  Bottom 0.305: U6.3 10.82,8.3 R4.1
OE_5V  (via drill 0.35)
  Top 0.152: v78.49,6.1 81.41,6.1 J1.15 | T.O.5.TP 75.44,4.32 v77.34,4.32
  Bottom 0.152: U2.10 61.85,11.95 61.85,11.36 65.27,7.94 65.86,7.94 67.7,6.1 v78.49,6.1 78.49,5.46 v77.34,4.32
PREAMP_BIAS
  Bottom 0.152: R2.2 112.84,19.69 112.84,15.39 112.71,15.25 112.03,15.25 U5.4 116.26,15.12 R1.2
PRU0.1_R1_3V3  (via drill 0.35)
  Top 0.152: v70.87,21.34 70.87,3.05 69.85,2.03 64.26,2.03 63.06,3.23 P1.33 | T.R1.3.TP 76.83,29.33 v76.83,27.12
  Bottom 0.152: v70.87,21.34 74.06,21.34 76.41,23.68 76.41,24.27 U1.19 76.65,26.94 v76.83,27.12
PRU0.2_B2_3V3  (via drill 0.35)
  Top 0.152: T.B2.3.TP 73.53,30.23 72.9,29.6 72.9,29.08 73.77,28.21 v73.77,27.3
  Bottom 0.152: P2.32 61.66,31.85 62.65,30.86 63.62,30.86 64.18,30.3 66.34,30.3 66.42,30.23 71.12,30.23 71.58,29.76 71.58,24.44 72.48,23.55 73.67,23.55 73.81,23.68 73.81,24.27 U1.15 74.05,27.02 v73.77,27.3
PRU0.3_R2_3V3  (via drill 0.35)
  Top 0.152: T.R2.3.TP 74.68,28.19 74.68,27.11 v74.65,27.08
  Bottom 0.152: U1.16 74.69,24.5 | 74.69,24.5 74.46,24.27 74.46,23.68 74.02,23.24 70.1,23.24 64.14,29.21 64.14,30 64.05,30 63.49,30.56 62.52,30.56 62.47,30.61 59.22,30.61 P2.30 | v74.65,27.08 74.69,27.04 74.69,24.5
PRU0.4_B1_3V3  (via drill 0.35)
  Top 0.152: v70.1,21.97 70.33,21.74 70.33,21.12 70.55,20.9 70.55,6.04 69.42,4.9 62.65,4.9 62.19,4.45 61.05,4.45 P1.31 | T.B1.3.TP 76.2,27.78 v76.04,27.78
  Bottom 0.152: v70.1,21.97 74.05,21.97 75.76,23.68 75.76,24.27 U1.18 76.04,24.55 v76.04,27.78
PRU0.5_G2_3V3  (via drill 0.35)
  Top 0.152: T.G2.3.TP 73.41,32 72.9,31.5 72.9,30.49 v72.68,30.26
  Bottom 0.152: U1.14 73.16,24.75 73.16,29.79 v72.68,30.26 72.34,30.61 64.3,30.61 P2.34
PRU0.6_CLK_3V3  (via drill 0.35)
  Top 0.152: T.CL.3.TP 80.77,29.97 v80.01,29.97
  Bottom 0.152: U1.21 77.71,24.75 77.71,29.97 | 77.71,29.97 77.71,31.69 76.25,33.15 56.74,33.15 P2.28 | v80.01,29.97 77.71,29.97
PRU0.7_G1_3V3  (via drill 0.35)
  Top 0.152: v69.76,21.25 70.23,20.77 70.23,6.15 69.29,5.21 60.41,5.21 59.12,3.91 P1.29 | T.G1.3.TP 75.31,32.51 v75.31,28.83
  Bottom 0.152: v69.76,21.25 69.69,21.25 69.34,21.59 69.34,21.97 69.35,21.97 69.88,22.5 70.32,22.5 70.47,22.35 73.91,22.35 75.35,23.79 U1.17 75.35,28.79 v75.31,28.83
R1_5V  (via drill 0.35)
  Top 0.152: T.R1.5.TP v77.85,20.32
  Bottom 0.152: J1.1 98.41,6.48 93.61,11.28 84.11,11.28 77.55,17.84 77.55,18.43 U1.5 77.3,19.77 v77.85,20.32
R2_5V  (via drill 0.35)
  Top 0.152: T.R2.5.TP 75.06,14.48 75.06,19.7 75.08,19.72 75.08,20.65 v75.37,20.95
  Bottom 0.152: J1.5 94.49,8.89 93.04,10.34 83.1,10.34 75.6,17.84 75.6,18.43 U1.8 75.37,18.69 v75.37,20.95
USB1.D_N  (via drill 0.25)
  Top 0.152: J2.D- 3.33,19.28 7.37,15.24 v7.37,8.89 7.49,8.76 U3.2
  Bottom 0.152: v7.37,8.89 7.37,4.57 11.01,0.93 31.33,0.93 v32.47,2.07 32.58,2.18 P1.9
USB1.D_P  (via drill 0.25)
  Top 0.152: J2.D+ 2.53,21.26 7.83,15.96 v7.83,9.36 7.99,9.2 U3.1 | P1.11 33.88,2.67 v32,2.67
  Bottom 0.152: v7.83,9.36 7.83,4.79 11.22,1.4 30.61,1.4 31.88,2.67 v32,2.67
USB1.VBUS  (via drill 0.35)
  Top 0.203: FB1.2 4.15,8.09
  Top 0.305: JP.USB.DC.2 4.1,4.69 C4.1 | v8.64,5.97 8.51,5.84 7.49,5.84 7.99,6.34 U3.6
  Top 0.406: 7.75,5.84 7.49,5.84 4.23,5.84 C4.1 4.1,7.8 FB1.2
  Bottom 0.305: C8.1 13.9,6.89 U6.1 | C8.1 14.42,4.48 C9.1 15.91,4.45 JP7.2 | C8.1 8.66,5.95 v8.64,5.97
VBUS.RAW
  Top 0.406: FB1.1 1.78,8.42 J2.VUSB
VIN  (via drill 0.35)
  Top 0.305: v20.07,5.33 21.49,3.91 P1.1
  Bottom 0.305: R4.2 11.26,11.74 U6.4 | U6.4 12,12.72 C6.1 | U6.5 13.9,12.85 C7.1 | U6.4 U6.5 | U6.5 19.52,5.38 19.53,5.38 19.58,5.33 v20.07,5.33

### Text on the board
tPlace: 2 | PocketBeagle Rev A2a | P2 | 36 | 35 | 1 | 2 | OSD3358 | 36 | 35 | 1 | P1 | beagleboard.org/pocket
bPlace: BAT | PRU0 | 58 | 57 | 60 | 52 | PB | + | T | 47 | 64 | 46 | 44 | RST | 6 | 3 | 2 | 5 | A7(1.8) | 59 | PWM1A | 23 | RX | TX | SCL | SDA | VOUT | GND | 65 | 27 | GND | +3.3V | MOSI | MISO | CLK | CS1 | 45 | A5/86 | U4 | I2C1 | SPI1 | P2 | P1 | SPI0 | I2C2 | U0 | A6/87 | 89 | CS0 | CLK | MISO | MOSI | +3.3V | GND | A+ | 20 | GND | VOUT | SDA | SCL | TX | RX | 26 | PWM0A | VIN | P1.10 | EN | VB | VI | - | + | ID | GND | - | 0 | 1 | 2 | 3 | 4 | 7 | 4 | 1 | USB1 | AIN (1.8V) | PRU0
Reference: 75 Mils back--> / Try to move back 75 Mils <---
tDocu: 112mm between holes | 4.409 inches